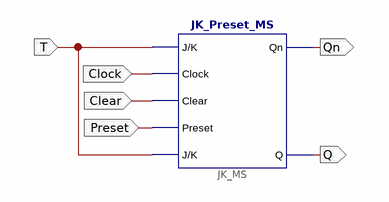
[diagram p0: schematic sheet 1]
// Xilinx ISE schematic T_Preset_MS.sch (spartan3e) as structural Verilog: 1 symbols, 6 ports
module T_Preset_MS (
  input  Clock,
  input  Clear,
  input  Preset,
  input  T,
  output Qn,
  output Q
);

  JK_Preset_MS JK_MS (.J(T), .Clock(Clock), .Clear(Clear), .Preset(Preset), .K(T), .Qn(Qn), .Q(Q));
endmodule
